# Altium schematic sheet Probe.SchDoc: Active probe evaluation board
size A4
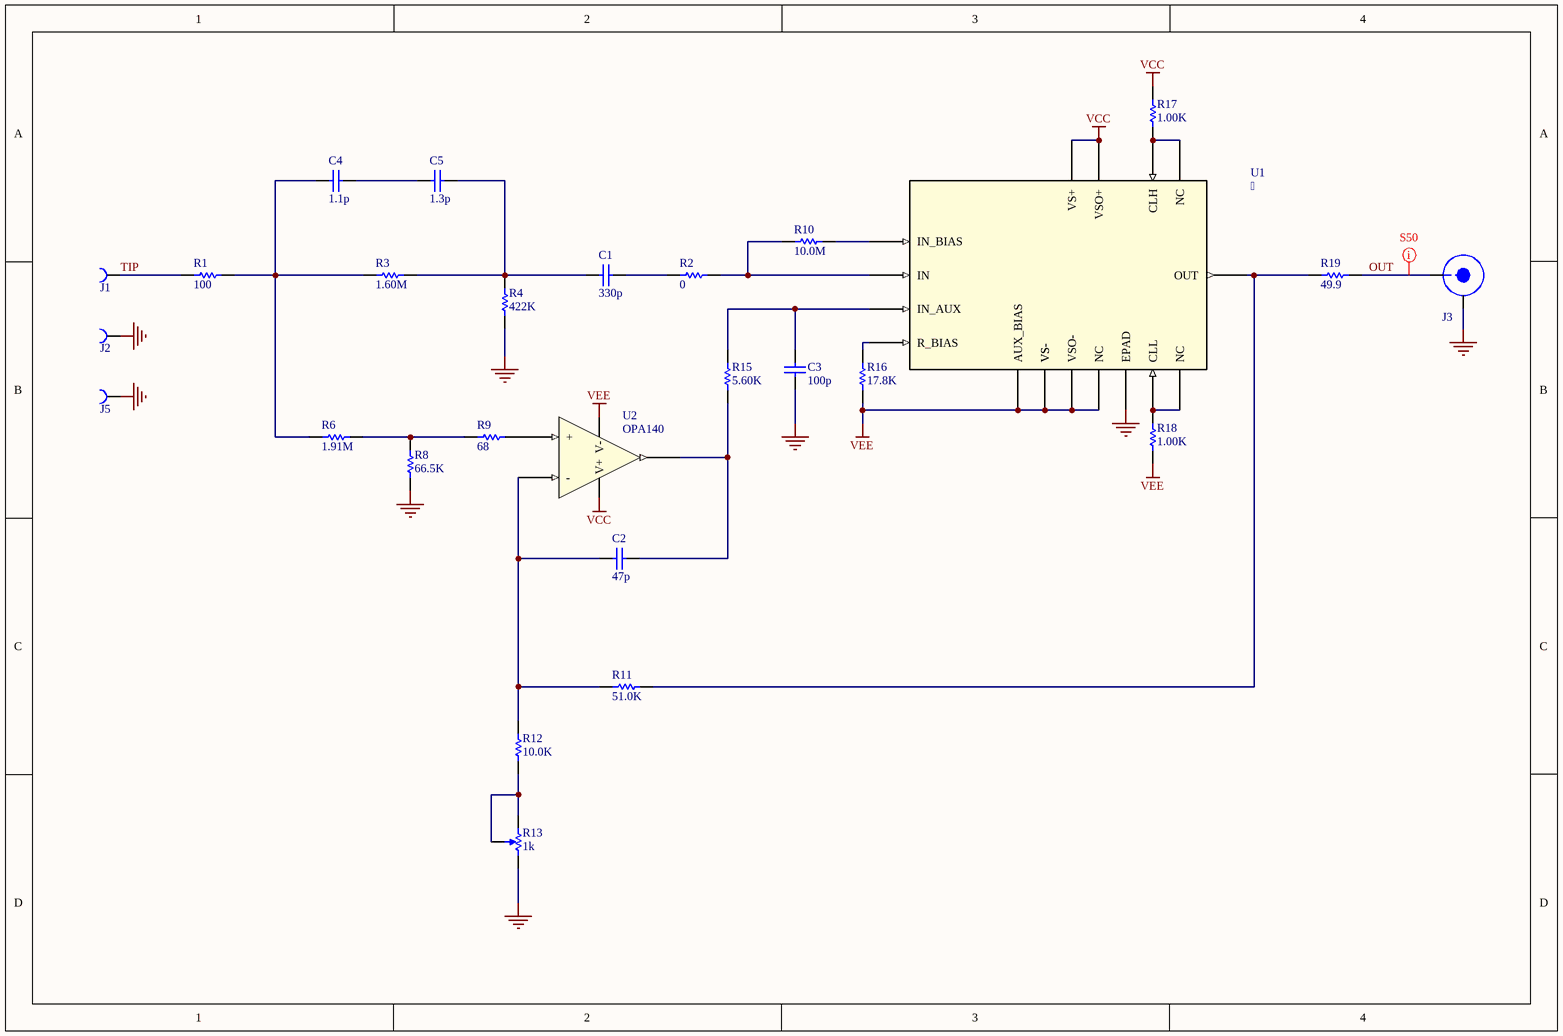
[diagram p0: Probe.SchDoc]

## Parts
C1  330p  [CAPC0402(1005)50_M]
C2  47p  [CAPC0402(1005)50_M]
C3  100p  [CAPC0402(1005)50_M]
C4  1.1p  [CAPC0402(1005)50_M]
C5  1.3p  [CAPC0402(1005)50_M]
J1  0339-0-15-01-15-27-10-0  [MILL-MAX 0339]  (value not drawn)
J2  0339-0-15-01-15-27-10-0  [MILL-MAX 0339]  (value not drawn)
J3  901-10511-3  [901-10511-3]  (value not drawn)
J5  0339-0-15-01-15-27-10-0  [MILL-MAX 0339]  (value not drawn)
R1  100  [RESC0402(1005)_M]
R2  0  [RESC0402(1005)_M]
R3  1.60M  [RESC0402(1005)_M]
R4  422K  [RESC0402(1005)_M]
R6  1.91M  [RESC0402(1005)_M]
R8  66.5K  [RESC0402(1005)_M]
R9  68  [RESC0402(1005)_M]
R10  10.0M  [RESC0402(1005)_M]
R11  51.0K  [RESC0402(1005)_M]
R12  10.0K  [RESC0402(1005)_M]
R13  1k  [PVG3A]
R15  5.60K  [RESC0402(1005)_M]
R16  17.8K  [RESC0402(1005)_M]
R17  1.00K  [RESC0402(1005)_M]
R18  1.00K  [RESC0402(1005)_M]
R19  49.9  [RESC0402(1005)_M]
U1    [VQFN16_RGT_TEX- OSHPARK]
U2  OPA140  [SOIC-8]

## Nets
GND: C3.2 J2.1 J3.2 J5.1 R4.2 R8.2 R13.3 U1.17(EPAD)
VCC: R17.2 U1.1(VS+) U1.12(VSO+) U2.7(V+)
VEE: R16.2 R18.2 U1.5(VS-) U1.6(AUX_BIAS) U1.8(VS-) U1.9(NC) U1.10(VSO-) U2.4(V-)
OUT: J3.1 R19.2
TIP: J1.1 R1.1
NetC1_1: C1.1 C5.2 R3.2 R4.1
NetC1_2: C1.2 R2.1
NetC2_1: C2.1 R11.1 R12.1 U2.2(-)
NetC2_2: C2.2 R15.2 U2.6(OUT)
NetC3_1: C3.1 R15.1 U1.4(IN_AUX)
NetC4_1: C4.1 R1.2 R3.1 R6.1
NetC4_2: C4.2 C5.1
NetR2_2: R2.2 R10.1 U1.2(IN)
NetR6_2: R6.2 R8.1 R9.1
NetR9_2: R9.2 U2.3(+)
NetR10_2: R10.2 U1.3(IN_BIAS)
NetR11_2: R11.2 R19.1 U1.11(OUT)
NetR12_2: R12.2 R13.1 R13.2
NetR16_1: R16.1 U1.7(R_BIAS)
NetR17_1: R17.1 U1.15(CLH) U1.16(NC)
NetR18_1: R18.1 U1.13(NC) U1.14(CLL)

## Layout directives
net class S50: OUT

## Notes on the sheet
- Title
- Size:
- Date:
- A4
- Number:
- Time:
- Revision:
- Sheet
- of
- File:

## Library data of the parts
C1 = GRM1555C1H331JA01: CAP CER 330PF±5% 50V C0G 0402; Manufacturer: Murata; Manufacturer Part Number: GRM1555C1H331JA01D; Capacitance: 330pF; Tolerance: ±5%; Value: 330p; Temperature Coefficient: C0G; Part Number: GRM1555C1H331JA01
C2 = CL05C470JB5NNN: CAP CER 47PF±5% 50V C0G 0402; Manufacturer: Samsung Electro-Mechanics; Manufacturer Part Number: CL05C470JB5NNNC; Capacitance: 47pF; Tolerance: ±5%; Voltage Rating: 50V; Temperature Coefficient: C0G; Part Number: CL05C470JB5NNN; Value: 47p
C3 = CL05C101JB5NNN: CAP CER 100PF±5% 50V C0G 0402; Manufacturer: Samsung Electro-Mechanics; Manufacturer Part Number: CL05C101JB5NNNC; Capacitance: 100pF; Tolerance: ±5%; Voltage Rating: 50V; Temperature Coefficient: C0G; Part Number: CL05C101JB5NNN; Value: 100p
C4 = GJM1555C1H1R1WB01: CAP CER 1.1PF±0.05PF 50V C0G/NP0 0402; Manufacturer: Murata; Manufacturer Part Number: GJM1555C1H1R1WB01D; Capacitance: 1.1pF; Tolerance: ±0.05pF; Temperature Coefficient: C0G; Part Number: GJM1555C1H1R1WB01; Value: 1.1p
C5 = GJM1555C1H1R3WB01: CAP CER 1.3PF±0.05PF 50V C0G/NP0 0402; Manufacturer: Murata; Manufacturer Part Number: GJM1555C1H1R3WB01D; Capacitance: 1.3pF; Tolerance: ±0.05pF; Temperature Coefficient: C0G; Part Number: GJM1555C1H1R3WB01; Value: 1.3p
J1 J2 J5 = 0339-0-15-01-15-27-10-0: CONN PIN RCPT; Manufacturer: Mill-Max; Supplier 1: Digi-Key; Supplier Part Number 1: 0339-0-15-01-15-27-10-0-ND; Manufacturer Part Number: 0339-0-15-01-15-27-10-0; Stock 1: 989; Pricing 1: 1=1.42, 10=1.234, 25=1.1812, 50=1.155, 100=1.1025, 250=0.99748, 500=0.91874, 1000=0.7875, 2500=0.735 (USD); Contact Material: Copper; Contact Plating: Gold; Min Operating Temperature: -55°C; Max Operating Temperature: 125°C; Series: 0339; Packaging: Bulk; Termination: Solder; RoHS Compliant: No; ComponentLink1URL: https://www.mill-max.com/assets/pdfs/172.pdf?src-supplier=Digi-Key; ComponentLink1Description: https://www.mill-max.com/assets/pdfs/172.pdf?src-supplier=Digi-Key; ComponentLink2URL: https://datasheet.octopart.com/0339-0-15-01-15-27-10-0-Mill-Max-datasheet-26446830.pdf?src-supplier=Future+Electronics; ComponentLink2Description: https://datasheet.octopart.com/0339-0-15-01-15-27-10-0-Mill-Max-datasheet-26446830.pdf?src-supplier=Future+Electronics; ComponentLink3URL: http://www.mouser.com/ds/2/273/172M-276194.pdf?src-supplier=Mouser; ComponentLink3Description: http://www.mouser.com/ds/2/273/172M-276194.pdf?src-supplier=Mouser; ComponentLink4URL: https://datasheet.octopart.com/0339-0-15-01-15-27-10-0-Mill-Max-datasheet-155663258.pdf?src-supplier=Sager+Electronics; ComponentLink4Description: https://datasheet.octopart.com/0339-0-15-01-15-27-10-0-Mill-Max-datasheet-155663258.pdf?src-supplier=Sager+Electronics; Supplier 2: Mouser; Supplier Part Number 2: 575-0339015011527100
J3 = 901-10511-3: CONN SMA JACK STR 50OHM EDGE MNT; Manufacturer: Amphenol RF; Impedance: 50R; Max Frequency: 26.5GHz; Voltage Rating: 170V; Supplier 1: Digi-Key; Manufacturer Part Number: 901-10511-3; Stock 1: 1568; Pricing 1: 1=9.78, 10=8.804, 25=8.2936, 50=8.081, 100=7.8684, 250=7.01772, 500=6.59242, 1000=5.82685 (USD); Case/Package: SMA; Contact Material: Copper; Min Operating Temperature: -65°C; Max Operating Temperature: 165°C; Connector Type: SMA; Fastening Type: Threaded; Series: -; Packaging: Bulk; Termination: Solder; ComponentLink1URL: https://datasheet.octopart.com/901-10511-3-Amphenol-RF-datasheet-67291285.pdf?src-supplier=Element14; ComponentLink1Description: https://datasheet.octopart.com/901-10511-3-Amphenol-RF-datasheet-67291285.pdf?src-supplier=Element14; Supplier 2: Mouser; Supplier Part Number 2: 523-901-10511-3; Supplier Part Number 1: ARF2500-ND; Mount: Edge,Board; RoHS Compliant: Yes; ComponentLink2URL: https://datasheet.octopart.com/901-10511-3-Amphenol-RF-datasheet-67291280.pdf?src-supplier=Newark; ComponentLink2Description: https://datasheet.octopart.com/901-10511-3-Amphenol-RF-datasheet-67291280.pdf?src-supplier=Newark; ComponentLink3URL: http://www.amphenolrf.com/media/downloads/7776/C901-10511-3.pdf?src-supplier=Digi-Key; ComponentLink3Description: http://www.amphenolrf.com/media/downloads/7776/C901-10511-3.pdf?src-supplier=Digi-Key
R1 = RESC0402-100R-1pct: RES 100 OHM 1% 1/16W 0402; Manufacturer 1: Yageo; Manufacturer Part Number 1: RC0402FR-07100RL; Part Number: RESC0402-100R-1pct; Ohms: 100; Value: 100; Manufacturer 2: Stackpole Electronics; Manufacturer Part Number 2: RMCF0402FT100R; Manufacturer 3: Vishay Dale; Manufacturer Part Number 3: CRCW0402100RFKED; Manufacturer 4: Panasonic Electronic Components; Manufacturer Part Number 4: ERJ-2RKF1000X
R2 = R0402-0R0-JMP: RES 0 OHM JUMPER 0402; Manufacturer 1: Yageo; Manufacturer Part Number 1: RC0402FR-071RL; Part Number: R0402-0R0-JMP; Ohms: 0; Value: 0; Manufacturer 2: Stackpole Electronics; Manufacturer Part Number 2: RMCF0402FT1R00; Manufacturer 3: Vishay Dale; Manufacturer Part Number 3: CRCW04021R00FNED; Manufacturer 4: Panasonic Electronic Components; Manufacturer Part Number 4: ERJ-2GE0R00X
R3 = RESC0402-1M60-1pct: RES 1.60M OHM 1% 1/16W 0402; Manufacturer 1: Yageo; Manufacturer Part Number 1: RC0402FR-071M6L; Ohms: 1600000; Part Number: RESC0402-1M60-1pct; Value: 1.60M; Manufacturer 2: Stackpole Electronics; Manufacturer Part Number 2: RMCF0402FT1M60; Manufacturer 3: Vishay Dale; Manufacturer Part Number 3: CRCW04021M60FKED; Manufacturer 4: Panasonic Electronic Components
R4 = RESC0402-422K-1pct: RES 422K OHM 1% 1/16W 0402; Manufacturer 1: Yageo; Manufacturer Part Number 1: RC0402FR-07422KL; Ohms: 422000; Part Number: RESC0402-422K-1pct; Value: 422K; Manufacturer 2: Stackpole Electronics; Manufacturer Part Number 2: RMCF0402FT422K; Manufacturer 3: Vishay Dale; Manufacturer Part Number 3: CRCW0402422KFKED; Manufacturer 4: Panasonic Electronic Components; Manufacturer Part Number 4: ERJ-2RKF4223X
R6 = RESC0402-1M91-1pct: RES 1.91M OHM 1% 1/16W 0402; Manufacturer 1: Yageo; Manufacturer Part Number 1: RC0402FR-071M91L; Ohms: 1910000; Part Number: RESC0402-1M91-1pct; Value: 1.91M; Manufacturer 2: Stackpole Electronics; Manufacturer Part Number 2: RMCF0402FT1M91; Manufacturer 3: Vishay Dale; Manufacturer Part Number 3: CRCW04021M91FKED; Manufacturer 4: Panasonic Electronic Components
R8 = RESC0402-66K5-1pct: RES 66.5K OHM 1% 1/16W 0402; Manufacturer 1: Yageo; Manufacturer Part Number 1: RC0402FR-0766K5L; Ohms: 66500; Part Number: RESC0402-66K5-1pct; Value: 66.5K; Manufacturer 2: Stackpole Electronics; Manufacturer Part Number 2: RMCF0402FT66K5; Manufacturer 3: Vishay Dale; Manufacturer Part Number 3: CRCW040266K5FKED; Manufacturer 4: Panasonic Electronic Components; Manufacturer Part Number 4: ERJ-2RKF6652X
R9 = RESC0402-68R0-1pct: RES 68 OHM 1% 1/16W 0402; Manufacturer 1: Yageo; Manufacturer Part Number 1: RC0402FR-0768RL; Part Number: RESC0402-68R0-1pct; Ohms: 68; Value: 68; Manufacturer 2: Stackpole Electronics; Manufacturer Part Number 2: RMCF0402FT68R0; Manufacturer 3: Vishay Dale; Manufacturer Part Number 3: CRCW040268R0FKED; Manufacturer 4: Panasonic Electronic Components; Manufacturer Part Number 4: ERJ-2RKF68R0X
R10 = RESC0402-10M0-1pct: RES 10.0M OHM 1% 1/16W 0402; Manufacturer 1: Yageo; Manufacturer Part Number 1: RC0402FR-0710ML; Ohms: 10000000; Part Number: RESC0402-10M0-1pct; Value: 10.0M; Manufacturer 2: Stackpole Electronics; Manufacturer Part Number 2: RMCF0402FT10M0; Manufacturer 3: Vishay Dale; Manufacturer Part Number 3: CRCW040210M0FKED; Manufacturer 4: Panasonic Electronic Components
R11 = RESC0402-51K0-1pct: RES 51.0K OHM 1% 1/16W 0402; Manufacturer 1: Yageo; Manufacturer Part Number 1: RC0402FR-0751KL; Ohms: 51000; Part Number: RESC0402-51K0-1pct; Value: 51.0K; Manufacturer 2: Stackpole Electronics; Manufacturer Part Number 2: RMCF0402FT51K0; Manufacturer 3: Vishay Dale; Manufacturer Part Number 3: CRCW040251K0FKED; Manufacturer 4: Panasonic Electronic Components; Manufacturer Part Number 4: ERJ-2RKF5102X
R12 = RESC0402-10K0-1pct: RES 10.0K OHM 1% 1/16W 0402; Manufacturer 1: Yageo; Manufacturer Part Number 1: RC0402FR-0710KL; Ohms: 10000; Part Number: RESC0402-10K0-1pct; Value: 10.0K; Manufacturer 2: Stackpole Electronics; Manufacturer Part Number 2: RMCF0402FT10K0; Manufacturer 3: Vishay Dale; Manufacturer Part Number 3: CRCW040210K0FKED; Manufacturer 4: Panasonic Electronic Components; Manufacturer Part Number 4: ERJ-2RKF1002X
R13 = PVG3A102C01R00: TRIMMER 1K OHM 0.25W J LEAD TOP; Manufacturer: Bourns; Resistance: 1kR; Number of Turns: 1; Max Power Dissipation: 250mW; Tolerance: 20%; Temperature Coefficient: 150ppm/°C; Supplier 1: Digi-Key; Supplier Part Number 1: 490-2643-6-ND; Manufacturer Part Number: PVG3A102C01R00; Stock 1: 4867; Pricing 1: 1=1.44, 10=1.273, 25=1.1452, 50=1.103, 100=1.0605, 250=0.99688, 500=0.8484 (USD); Mount: Surface Mount; Packaging: Cut Tape; Resistor Type: Cermet; Height: 0.079inch; ComponentLink1URL: https://datasheet.octopart.com/PVG3A102C01R00-Bourns-datasheet-154729832.pdf?src-supplier=Newark; ComponentLink1Description: https://datasheet.octopart.com/PVG3A102C01R00-Bourns-datasheet-154729832.pdf?src-supplier=Newark; ComponentLink2URL: https://datasheet.octopart.com/PVG3A102C01R00-Bourns-datasheet-82548162.pdf?src-supplier=Element14; ComponentLink2Description: https://datasheet.octopart.com/PVG3A102C01R00-Bourns-datasheet-82548162.pdf?src-supplier=Element14; ComponentLink3URL: https://www.bourns.com/docs/Product-Datasheets/pvg3.pdf?src-supplier=Digi-Key; ComponentLink3Description: https://www.bourns.com/docs/Product-Datasheets/pvg3.pdf?src-supplier=Digi-Key; ComponentLink4URL: http://www.bourns.com/docs/Product-Datasheets/pvg3.pdf?src-supplier=Digi-Key; ComponentLink4Description: http://www.bourns.com/docs/Product-Datasheets/pvg3.pdf?src-supplier=Digi-Key; ComponentLink5URL: https://www.mouser.com/ds/2/54/vg3-1084610.pdf?src-supplier=Mouser; ComponentLink5Description: https://www.mouser.com/ds/2/54/vg3-1084610.pdf?src-supplier=Mouser; Supplier 2: Mouser; Supplier Part Number 2: 81-PVG3A102C01R00
R15 = RESC0402-5K60-1pct: RES 5.60K OHM 1% 1/16W 0402; Manufacturer 1: Yageo; Manufacturer Part Number 1: RC0402FR-075K6L; Ohms: 5600; Part Number: RESC0402-5K60-1pct; Value: 5.60K; Manufacturer 2: Stackpole Electronics; Manufacturer Part Number 2: RMCF0402FT5K60; Manufacturer 3: Vishay Dale; Manufacturer Part Number 3: CRCW04025K60FKED; Manufacturer 4: Panasonic Electronic Components; Manufacturer Part Number 4: ERJ-2RKF5601X
R16 = RESC0402-17K8-1pct: RES 17.8K OHM 1% 1/16W 0402; Manufacturer 1: Yageo; Manufacturer Part Number 1: RC0402FR-0717K8L; Ohms: 17800; Part Number: RESC0402-17K8-1pct; Value: 17.8K; Manufacturer 2: Stackpole Electronics; Manufacturer Part Number 2: RMCF0402FT17K8; Manufacturer 3: Vishay Dale; Manufacturer Part Number 3: CRCW040217K8FKED; Manufacturer 4: Panasonic Electronic Components; Manufacturer Part Number 4: ERJ-2RKF1782X
R17 R18 = RESC0402-1K00-1pct: RES 1.00K OHM 1% 1/16W 0402; Manufacturer 1: Yageo; Manufacturer Part Number 1: RC0402FR-071KL; Ohms: 1000; Part Number: RESC0402-1K00-1pct; Value: 1.00K; Manufacturer 2: Stackpole Electronics; Manufacturer Part Number 2: RMCF0402FT1K00; Manufacturer 3: Vishay Dale; Manufacturer Part Number 3: CRCW04021K00FKED; Manufacturer 4: Panasonic Electronic Components; Manufacturer Part Number 4: ERJ-2RKF1001X
R19 = RESC0402-49R9-1pct: RES 49.9 OHM 1% 1/16W 0402; Manufacturer 1: Yageo; Manufacturer Part Number 1: RC0402FR-0749R9L; Part Number: RESC0402-49R9-1pct; Ohms: 49.9; Value: 49.9; Manufacturer 2: Stackpole Electronics; Manufacturer Part Number 2: RMCF0402FT49R9; Manufacturer 3: Vishay Dale; Manufacturer Part Number 3: CRCW040249R9FKED; Manufacturer 4: Panasonic Electronic Components; Manufacturer Part Number 4: ERJ-2RKF49R9X
U1 = BUF802IRGTR: WIDE-BANDWIDTH JFET BUFFER; Manufacturer: Texas Instruments; Supplier 1: Digi-Key; Manufacturer Part Number: BUF802IRGTR; Stock 1: 1253; Pricing 1: 1=5.06, 10=4.541, 25=4.2928, 100=3.7206, 250=3.5298, 500=3.16728, 1000=2.88 (USD); Supplier 2: Mouser; Supplier Part Number 1: 296-BUF802IRGTRCT-ND; Supplier Part Number 2: 595-BUF802IRGTR
U2 = OPA140AIDR: IC OPAMP JFET 1 CIRCUIT 8SOIC; Manufacturer: Texas Instruments; Slew Rate: 20V/µs; Output Current per Channel: 36mA; Number of Circuits: 1; Gain Bandwidth Product: 11MHz; Input Bias Current: 10pA; Input Offset Voltage (Vos): 30uV; Operating Supply Current: 1.8mA; Min Dual Supply Voltage: 2.25V; Max Dual Supply Voltage: 18V; Max Supply Voltage: 36V; Min Supply Voltage: 4.5V; Nominal Supply Current: 2mA; Voltage Gain: 126dB; Max I/O Voltage: 120uV; Power Supply Rejection Ratio (PSRR): 140dB; Supplier 1: Digi-Key; Manufacturer Part Number: OPA140AIDR; Stock 1: 3434; Pricing 1: 1=4.01, 10=3.606, 25=3.4088, 100=2.9542, 250=2.80276, 500=2.5149, 1000=2.121 (USD); Number of Pins: 8; Min Operating Temperature: -40°C; Max Operating Temperature: 125°C; Series: -; Packaging: Tape and Reel; RoHS Compliant: Yes; ComponentLink1URL: https://datasheet.ciiva.com/14459/sbos498a-14459066.pdf?src-supplier=Avnet; ComponentLink1Description: https://datasheet.ciiva.com/14459/sbos498a-14459066.pdf?src-supplier=Avnet; Supplier 2: Mouser; Supplier Part Number 1: 296-43606-6-ND; Supplier Part Number 2: 595-OPA140AIDR; Case/Package: D; Contact Plating: Gold; Package Quantity: 2500; Number of Elements: 1; Output Current: 36mA; Unity Gain Bandwidth Product: 11MHz; Common Mode Rejection Ratio: 126dB; Nominal Gain Bandwidth Product: 11MHz; Number of Channels: 1; Operating Supply Voltage: 18V; Supply Current: 2mA; Technology: BIFET; Radiation Hardening: No; Lead Free: Lead Free; ComponentLink2URL: https://datasheet.ciiva.com/1815/opa140-1815515.pdf?src-supplier=Digi-Key; ComponentLink2Description: https://datasheet.ciiva.com/1815/opa140-1815515.pdf?src-supplier=Digi-Key